# EAGLE design small_line (EAGLE 9.4.0)
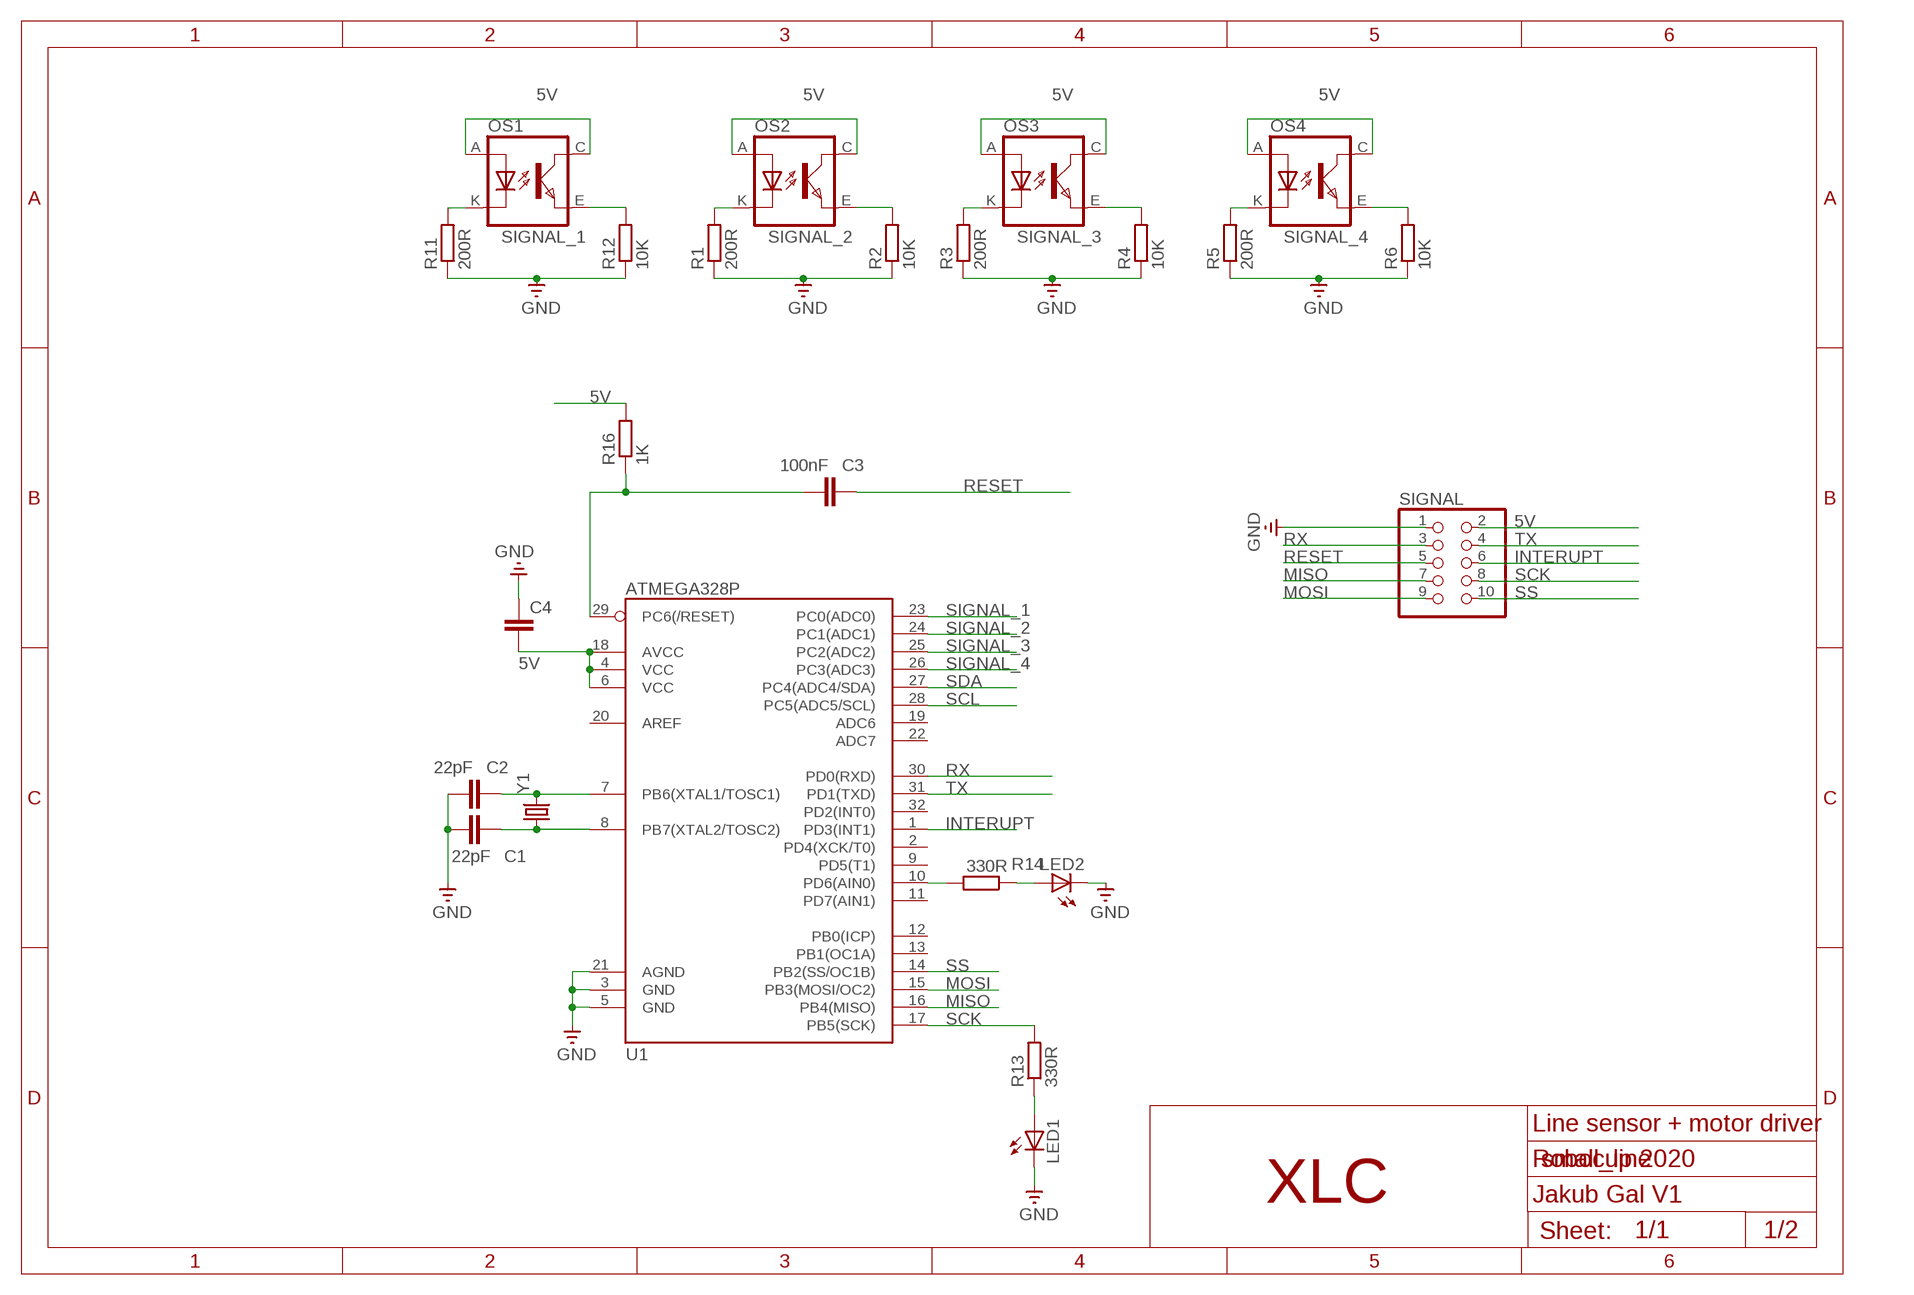
[diagram p0: schematic, sheet 1]

## Parts
C1  22pF  C-EUC0603  [C0603]
C2  22pF  C-EUC0603  [C0603]
C3  100nF  C-EUC0603  [C0603]
C4  C-EUC0603  [C0603]
LED1  LEDCHIPLED_0603  [CHIPLED_0603]
LED2  LEDCHIPLED_0603  [CHIPLED_0603]
OS1  TCRT5000  [TCRT5000]
OS2  TCRT5000  [TCRT5000]
OS3  TCRT5000  [TCRT5000]
OS4  TCRT5000  [TCRT5000]
R1  200R  R-EU_R0603  [R0603]
R2  10K  R-EU_R0603  [R0603]
R3  200R  R-EU_R0603  [R0603]
R4  10K  R-EU_R0603  [R0603]
R5  200R  R-EU_R0603  [R0603]
R6  10K  R-EU_R0603  [R0603]
R11  200R  R-EU_R0603  [R0603]
R12  10K  R-EU_R0603  [R0603]
R13  330R  R-EU_R0603  [R0603]
R14  330R  R-EU_R0603  [R0603]
R16  1K  R-EU_R0603  [R0603]
SIGNAL  PINHD-2X5  [2X05]
U1  ATMEGA328P  ATMEGA328_SMT  [TQFP32-08]
Y1  CRYSTALHC49US  [HC49US]

## Nets
5V: C4.2 OS1.A(ANODE) OS1.C(COLLECTOR) OS2.A(ANODE) OS2.C(COLLECTOR) OS3.A(ANODE) OS3.C(COLLECTOR) OS4.A(ANODE) OS4.C(COLLECTOR) R16.2 SIGNAL.2 U1.4(VCC) U1.6(VCC) U1.18(AVCC)
GND: C1.1 C2.1 C4.1 LED1.C LED2.C R1.1 R2.1 R3.1 R4.1 R5.1 R6.1 R11.1 R12.1 SIGNAL.1 U1.3(GND) U1.5(GND) U1.21(AGND)
INTERUPT: SIGNAL.6 U1.1(PD3(INT1))
MISO: SIGNAL.7 U1.16(PB4(MISO))
MOSI: SIGNAL.9 U1.15(PB3(MOSI/OC2))
N$1: OS2.K(CATHODE) R1.2
N$2: OS3.K(CATHODE) R3.2
N$3: OS4.K(CATHODE) R5.2
N$6: OS1.K(CATHODE) R11.2
N$7: C2.2 U1.7(PB6(XTAL1/TOSC1)) Y1.2
N$8: C1.2 U1.8(PB7(XTAL2/TOSC2)) Y1.1
N$16: C3.1 R16.1 U1.29(PC6(/RESET))
N$17: LED1.A R13.1
N$19: LED2.A R14.1
N$22: R14.2 U1.10(PD6(AIN0))
RESET: C3.2 SIGNAL.5
RX: SIGNAL.3 U1.30(PD0(RXD))
SCK: R13.2 SIGNAL.8 U1.17(PB5(SCK))
SCL: U1.28(PC5(ADC5/SCL))
SDA: U1.27(PC4(ADC4/SDA))
SIGNAL_1: OS1.E(EMITTER) R12.2 U1.23(PC0(ADC0))
SIGNAL_2: OS2.E(EMITTER) R2.2 U1.24(PC1(ADC1))
SIGNAL_3: OS3.E(EMITTER) R4.2 U1.25(PC2(ADC2))
SIGNAL_4: OS4.E(EMITTER) R6.2 U1.26(PC3(ADC3))
SS: SIGNAL.10 U1.14(PB2(SS/OC1B))
TX: SIGNAL.4 U1.31(PD1(TXD))
Unconnected: U1.2(PD4(XCK/T0)) U1.9(PD5(T1)) U1.11(PD7(AIN1)) U1.12(PB0(ICP)) U1.13(PB1(OC1A)) U1.19(ADC6) U1.20(AREF) U1.22(ADC7) U1.32(PD2(INT0))

## Notes on the sheet
- Line sensor + motor driver
- Robocup 2020
- XLC | Jakub Gal V1
- 1/2

## Library data of the parts
C1-C3 = rcl:C-EU: CAPACITOR, European symbol
C4 = rcl:C-EU: CAPACITOR, European symbol; SPICEPREFIX: C
LED1 LED2 = audio amplifier example:LED
OS1-OS4 = tcrt5000:TCRT5000
R1-R6 R11-R14 R16 = rcl:R-EU_: RESISTOR, European symbol; SPICEPREFIX: R
SIGNAL = pinhead:PINHD-2X5: PIN HEADER
U1 = SparkFun-DigitalIC:ATMEGA328_SMT: 32-Pin Atmega328 part Commonly used on Arduino compatible boards Available in QFP and QFN packages TQFP is IC-09069 QFN is non-stock; PROD_ID: IC-09069
Y1 = SparkFun-FreqCtrl:CRYSTAL: Various standard crystals. Proven footprints. Spark Fun Electronics SKU : COM-00534

## Board
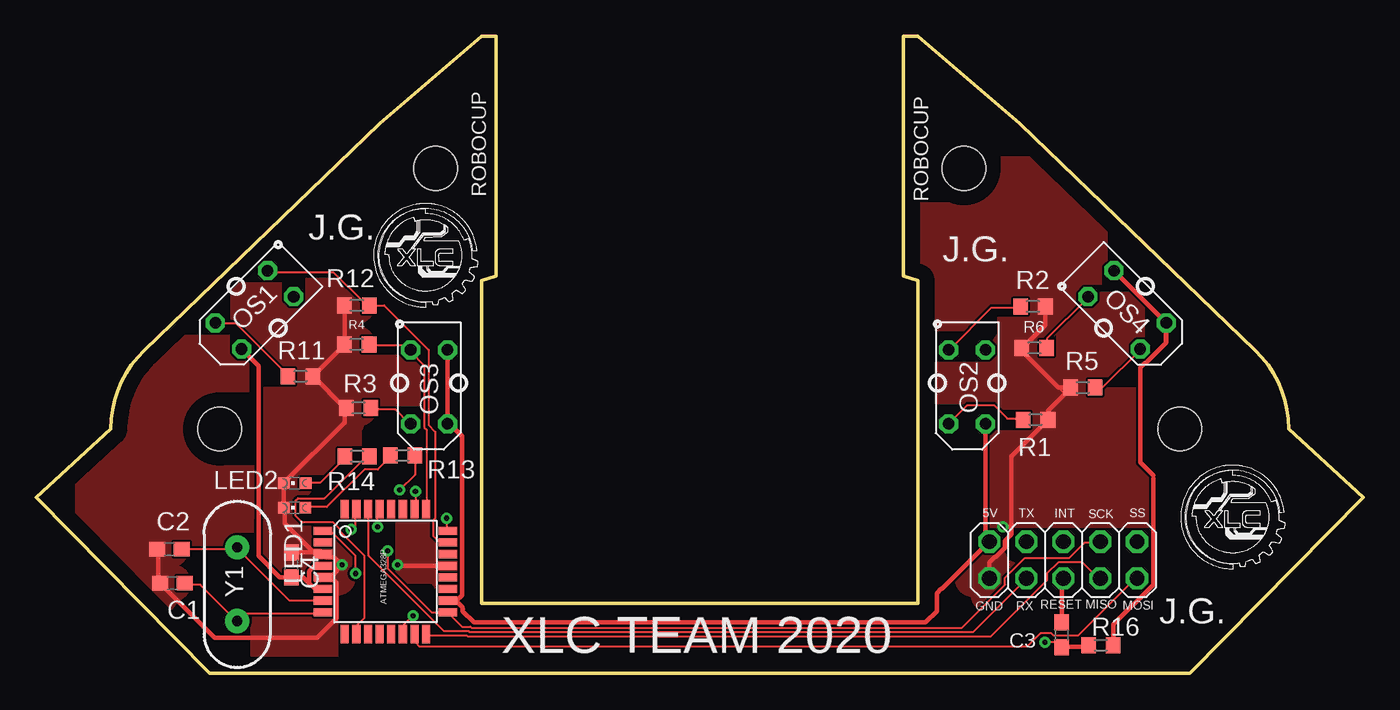
[diagram p1: board, top side]
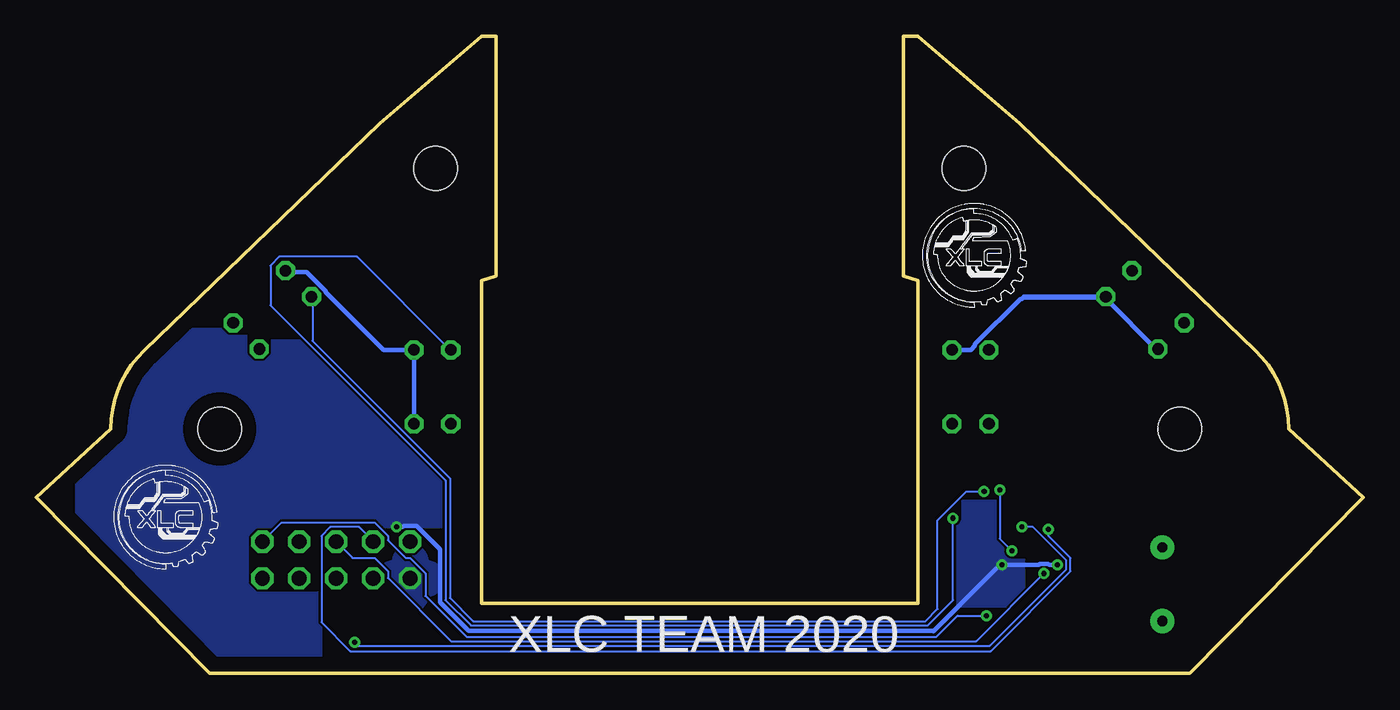
[diagram p2: board, bottom side, seen from below]

Size 91.23 x 43.81 mm. Coordinates in mm from the lower left corner, seen from the top.
Outline: 59.61,27.31 60.61,27 60.61,4.81 30.61,4.81 30.61,27 31.61,27.31 31.61,43.81 30.61,43.81 23.61,37.81 7.41,22.21 arc46 5.11,16.81 0,12.11 11.93,0 79.3,0 91.23,12.11 86.11,16.81 arc46 83.82,22.21 67.61,37.81 60.61,43.81 59.61,43.81 59.61,27.31
Copper layers (1*16): Top 0.035mm / dielectric 1.5mm / Bottom 0.035mm
Design rules "default": minimum track width 6mil, minimum drill 0.35mm, track to track 6mil, track to pad 6mil, pad to pad 6mil, via to via 6mil, smd to smd 6mil, copper to edge 40mil, drill to drill 6mil, minimum pad ring 10mil, minimum via ring 8mil, stop-mask expansion 4mil, vias tented up to drill 0mil, thermal gap 10mil
Holes 3 mm at 78.61,16.81 63.77,34.73 27.46,34.73 12.61,16.81

### Footprints (pad centres in the part's own frame; a part is rotated, then mirrored left to right if it is on the bottom)
C0603 = smd 1.1 x 1: 1 -0.85,0; 2 0.85,0
CHIPLED_0603 = smd 0.8 x 0.8: A 0,-0.75; C 0,0.75
TCRT5000 = drill 0.8 octagon: A -2.54,-1.27; C 2.54,-1.27; E 2.54,1.27; K -2.54,1.27
R0603 = smd 1 x 1.1: 1 -0.85,0; 2 0.85,0
2X05 = drill 1.016 octagon: 1 -5.08,-1.27; 2 -5.08,1.27; 3 -2.54,-1.27; 4 -2.54,1.27; 5 0,-1.27; 6 0,1.27; 7 2.54,-1.27; 8 2.54,1.27; 9 5.08,-1.27; 10 5.08,1.27
TQFP32-08 = smd 1.27 x 0.559: 1 -4.293,2.8; 2 -4.293,2; 3 -4.293,1.2; 4 -4.293,0.4; 5 -4.293,-0.4; 6 -4.293,-1.2; 7 -4.293,-2; 8 -4.293,-2.8; 17 4.293,-2.8; 18 4.293,-2; 19 4.293,-1.2; 20 4.293,-0.4; 21 4.293,0.4; 22 4.293,1.2; 23 4.293,2; 24 4.293,2.8 | smd 0.559 x 1.27: 9 -2.8,-4.293; 10 -2,-4.293; 11 -1.2,-4.293; 12 -0.4,-4.293; 13 0.4,-4.293; 14 1.2,-4.293; 15 2,-4.293; 16 2.8,-4.293; 25 2.8,4.293; 26 2,4.293; 27 1.2,4.293; 28 0.4,4.293; 29 -0.4,4.293; 30 -1.2,4.293; 31 -2,4.293; 32 -2.8,4.293
HC49US = drill 0.7 pad 1.651: 1 -2.54,0; 2 2.54,0

### Placement (x,y rotation side)
C1  9.35,6.19 0 top
C2  9.15,8.53 0 top
C3  70.5,2.64 90 top
C4  17.53,7.46 270 top
LED1  17.76,11.38 90 top
LED2  17.77,13.08 90 top
OS1  15,25 45 top
OS2  64,19.7 90 top
OS3  27,19.7 90 top
OS4  75,25 135 top
R1  68.7,17.44 180 top
R2  68.53,25.23 180 top
R3  22.16,18.26 0 top
R4  22.03,22.62 0 top
R5  71.95,19.65 0 top
R6  68.61,22.38 0 top
R11  18.16,20.43 180 top
R12  22.04,25.3 0 top
R13  25.19,14.98 0 top
R14  22.05,14.92 0 top
R16  73.19,1.92 0 top
SIGNAL  70.61,7.79 0 top
U1  24,7 0 top
Y1  13.81,6.13 90 top

### Tracks (layer width: path | path; a pad name or v marks a point on that pad's centre or on a via)
5V
  Top 0.152: 28.8,5.03 28.35,5.03 U1.18 28.8,5.03 | 28.8,5.03 29.26,5.49 29.26,16.15 28.35,17.07 OS3.A 28.35,17.22 28.35,22.1 OS3.C | 18.75,6.25 18.75,7.01 18.87,7.13 | 19.4,7.32 19.66,7.32 U1.4 | 15.27,10.5 15.24,10.54 15.24,17.8 | 74.07,3.35 74.07,1.98 R16.2 | 76.81,13.6 76.81,13.4 | 75.89,21 75.89,21.03 77.57,22.71 77.57,24.08 OS4.A 77.57,24.23 74.22,27.58 OS4.C | 28.8,5.03 29.41,4.42 29.41,4.27 29.69,3.99 | 52.9,3.5 61.11,3.5 61.45,3.85
  Top 0.305: 28.87,4.97 28.84,5 U1.18 | 28.87,4.97 29.32,4.52 29.32,4.27 30.09,3.5 52.9,3.5 61.14,3.5 61.91,4.27 61.91,5.51 62.2,5.8 62.27,5.8 SIGNAL.2 | SIGNAL.2 65.31,8.84 65.23,8.84 | SIGNAL.2 65.27,9.32 OS2.A | OS4.C 77.57,24.22 77.57,24.08 | 75.89,21.03 76.21,21.35 76.3,21.35 77.69,22.75 OS4.A | 75.89,21 75.89,14.51 76.81,13.6 | 76.81,13.4 76.81,6.1 74.07,3.35 74.04,3.33 R16.2 | 28.87,4.97 29.26,5.36 29.26,16.15 29.26,16.31 28.35,17.22 | OS3.A OS3.C | OS1.A 15.28,21.12 15.28,10.51 15.27,10.5 15.27,8.07 16.73,6.61 C4.2 18.35,6.61 18.77,6.19 | 18.77,6.19 18.77,6.23 18.75,6.25 | U1.6 19.16,5.8 18.77,6.19 | 18.75,6.25 18.77,6.27 18.77,7.01 18.87,7.11 18.87,7.13 19.05,7.32 19.4,7.32
  Bottom 0.152: 14.17,22.25 OS1.A | 23.47,25.76 17.83,25.76 OS1.C | 65.23,22.12 OS2.C | 74.07,27.58 OS4.C
  Bottom 0.305: OS2.A 65.27,22.08 65.23,22.12 | OS2.C 67.35,22.24 71.35,26.24 71.35,26.3 72.64,27.58 74.07,27.58 | OS3.C 26.98,22.25 26.69,22.54 26.69,22.64 23.57,25.76 23.47,25.76 23.33,25.9 OS1.C 17.69,25.77 14.17,22.25
GND  (via drill 0.35)
  Top 0.152: 70.71,19.2 71.02,19.51 R5.1 70.71,19.2 | 67.82,22.4 R6.1 67.67,22.25 67.97,21.94 70.71,19.2 | 65.53,7.62 65.53,7.56 | 67.06,10.06 67.06,9.96 | 69.25,17.12 69.49,17.37 R1.1 | 67.06,14.94 67.07,14.95 | 21.03,22.55 R4.1 | 19.05,20.42 R11.1 | R12.1 | 8.38,6.45 8.38,6.25 C1.1 | 20.27,6.71 19.81,6.71 U1.5 19.98,6.65 20.27,6.71 | 20.27,6.71 20.57,7.01 20.57,7.47 | 20.57,7.47 20.57,7.77 20.27,8.08 19.81,8.08 U1.3 | v24.85,7.47 v24.84,7.47 | 20.57,7.47 20.85,7.47 | 18.97,8.47 17.07,10.36 17.07,10.44 17.07,11.28 LED1.C 17.07,11.43 17.07,12.95 LED2.C 17.07,13.11 17.1,13.14 21.18,17.22 | 20.57,3.81 20.57,6.4 20.27,6.71 | 21.18,18.14 R3.1
  Top 0.305: C2.1 8.38,8.45 8.38,6.45 | C1.1 12.25,2.44 19.29,2.44 20.65,3.79 20.65,6.21 20.2,6.65 19.98,6.65 | v21.03,7.47 20.65,7.08 20.65,6.99 20.25,6.6 U1.5 | v21.03,7.47 20.98,7.47 20.47,7.98 19.92,7.98 U1.3 19.6,8.31 | v21.03,7.47 20.85,7.47 | 20.85,7.47 20.73,7.47 20.65,7.38 20.76,7.38 20.85,7.47 | 19.6,8.31 19.49,8.42 18.95,8.42 17.07,10.29 17.07,10.44 17.07,11.32 LED1.C 17.01,13.05 17.1,13.14 | LED2.C 21.16,17.22 21.18,17.22 21.18,18.14 | R3.1 21.21,18.26 19.05,20.42 | R11.1 21.03,22.45 21.03,22.55 | R4.1 R12.1 | U1.21 24.92,7.4 v24.85,7.47 | v66.45,10.06 67.06,10.06 67.06,14.94 | 67.06,9.96 67.06,9.55 66.6,9.1 66.6,8.62 65.97,7.99 65.91,7.99 65.53,7.62 | 65.53,7.56 SIGNAL.1 | 67.07,14.95 69.25,17.12 | R1.1 69.55,18.04 70.71,19.2 | R5.1 70.27,19.65 67.97,21.94 | R2.1 69.38,23.96 67.82,22.4 | C4.1 19.6,8.31
  Bottom 0.152: 61.47,2.94 61.42,2.9 29.55,2.9
  Bottom 0.305: v21.03,7.47 21.59,7.47 21.66,7.54 22.23,7.54 22.3,7.47 v24.84,7.47 24.98,7.47 29.55,2.9 29.56,2.9 61.51,2.9 63.48,4.87 63.48,8.51 65.09,10.13 65.97,10.13 66.04,10.06 v66.45,10.06
  pour Top: -1.88,45.86 -1.88,-1.57 93.59,-1.57 93.59,45.86
  pour Bottom: -5.22,48.42 -5.22,-5.45 96.51,-5.45 96.51,48.42
INTERUPT  (via drill 0.35)
  Top 0.152: v21.95,6.86 21.95,8.08 20.27,9.75 19.81,9.75 U1.1
  Bottom 0.152: SIGNAL.6 70.56,8.99 69.49,7.92 67.97,7.92 67.06,7.01 67.06,6.55 62.71,2.21 26.59,2.21 v21.95,6.86
MISO
  Top 0.152: U1.16 26.82,2.59 29.6,2.59 29.68,2.52 65.61,2.52 69.49,6.4 69.49,6.86 70.26,7.62 71.93,7.62 73,6.55 SIGNAL.7
MOSI
  Top 0.152: U1.15 26.06,2.59 26.06,2.13 26.36,1.83 68.12,1.83 69.04,2.74 69.8,2.74 69.95,2.59 71.63,2.59 75.59,6.55 SIGNAL.9
N$1
  Top 0.152: R1.2 67.82,17.53 66.75,17.53 65.84,18.44 64.01,18.44 62.79,17.22 OS2.K
N$2
  Top 0.152: R3.2 23.01,18.14 24.69,18.14 25.6,17.22 OS3.K
N$3
  Top 0.152: R5.2 72.85,19.66 73.3,19.66 75.89,22.25 OS4.K
N$6
  Top 0.152: R11.2 17.22,20.57 13.72,24.08 12.34,24.08 OS1.K
N$7
  Top 0.152: C2.2 10.06,8.53 13.72,8.53 Y1.2 13.87,8.53 17.37,5.03 19.66,5.03 U1.7
N$8
  Top 0.152: C1.2 10.21,6.1 11.28,6.1 13.72,3.66 Y1.1 13.87,3.66 14.33,4.12 19.66,4.12 U1.8
N$16  (via drill 0.35)
  Top 0.152: 70.7,1.83 70.56,1.83 C3.1 70.41,1.83 70.1,2.13 v69.34,2.13 | v23.47,10.06 23.47,11.28 U1.29
  Top 0.305: R16.1 72.25,1.83 70.7,1.83
  Bottom 0.152: v23.47,10.06 22.71,10.06 20.42,7.77 20.42,7.16 25.68,1.91 69.11,1.91 v69.34,2.13
N$17
  Top 0.152: LED1.A 18.59,11.43 19.96,11.43 22.55,14.02 23.47,14.02 24.38,14.94 R13.1
N$19
  Top 0.152: LED2.A 18.59,13.11 19.51,13.11 21.18,14.78 R14.1
N$22
  Top 0.152: R14.2 22.86,14.78 22.55,14.78 19.81,12.04 17.98,12.04 17.83,11.89 17.83,10.82 18.29,10.36 20.42,10.36 20.88,9.91 20.88,9.75 22.55,8.08 22.55,3.81 22.1,3.35 22.1,2.74 U1.10
RESET
  Top 0.305: C3.2 70.5,6.41 SIGNAL.5
RX
  Top 0.152: U1.30 22.86,11.28 22.86,8.08 28.04,2.9 29.73,2.9 29.8,2.82 64.39,2.82 67.97,6.4 SIGNAL.3
SCK  (via drill 0.35)
  Top 0.152: 25.91,14.94 R13.2 26.04,13.66 v24.98,12.6 | 28.19,4.27 U1.17 | SIGNAL.8 73,8.99 72.08,8.99 71.02,7.92 67.97,7.92 66.6,6.55 66.6,6.1 63.63,3.12 29.93,3.12 29.85,3.2 29.26,3.2 28.35,4.12 U1.17 | U1.17 27.17,4.2 24.15,7.22 v24.15,8.42
  Bottom 0.152: v24.98,12.6 24.98,9.25 v24.15,8.42
SIGNAL_1
  Top 0.152: OS1.E 16,27.58 20.42,27.58 22.55,25.45 22.86,25.45 R12.2 23.01,25.3 23.93,25.3 26.98,22.25 26.98,17.07 27.43,16.61 27.43,10.67 27.28,10.52 27.28,9.45 27.58,9.14 28.19,9.14 U1.23
SIGNAL_2  (via drill 0.35)
  Top 0.152: R2.2 67.67,25.15 65.68,25.15 62.79,22.25 OS2.E | v28.19,10.67 28.19,9.91 U1.24
  Bottom 0.152: v28.19,10.67 28.19,5.03 29.94,3.29 61.35,3.29 63.09,5.03 63.09,13.26 75.13,25.3 75.13,28.04 74.52,28.65 69.19,28.65 62.79,22.25 OS2.E
SIGNAL_3
  Top 0.152: R4.2 23.01,22.55 25.3,22.55 25.6,22.25 OS3.E 25.76,22.1 26.67,21.18 26.67,16.92 26.82,16.76 26.82,11.43 U1.25
SIGNAL_4  (via drill 0.35)
  Top 0.152: R6.2 69.49,22.4 69.49,23.01 72.24,25.76 OS4.E | v26.06,12.5 26.06,11.43 U1.26
  Bottom 0.152: v26.06,12.5 27.28,12.5 29.26,10.52 29.26,4.42 30.09,3.59 61.2,3.59 62.79,5.18 62.79,13.41 72.24,22.86 72.24,25.76 OS4.E
SS  (via drill 0.35)
  Top 0.152: v25.91,3.96 25.3,3.35 25.3,2.74 U1.14
  Bottom 0.152: v25.91,3.96 27.89,3.96 29.34,2.52 61.66,2.52 64.47,5.32 64.47,6.86 65.53,7.92 65.84,7.92 67.06,9.14 67.06,9.45 67.97,10.36 74.37,10.36 75.59,9.14 SIGNAL.10
TX  (via drill 0.35)
  Top 0.152: v21.64,9.91 21.95,10.21 21.95,11.28 U1.31
  Bottom 0.152: v21.64,9.91 21.64,9.45 20.12,7.92 20.12,7.01 25.6,1.52 69.65,1.52 71.63,3.5 71.63,9.45 71.02,10.06 69.04,10.06 68.12,9.14 SIGNAL.4

### Text on the board
tNames: ROBOCUP | ROBOCUP | J.G. | J.G. | 5V | TX | INT | SCK | SS | GND | RX | RESET | MISO | MOSI | C3 | J.G. | XLC TEAM 2020
bNames: XLC TEAM 2020